# Altium schematic sheet Battery3.SchDoc
size A
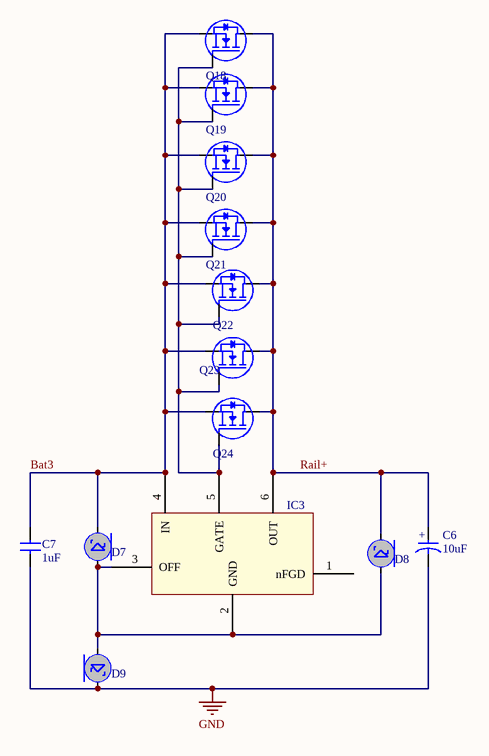
[diagram p0: Battery3.SchDoc]

## Parts
C6  value 10uF  [CAP22uF100V]  (hidden comment: CapPol)
C7  value 1uF  [CAPC1206]  (hidden comment: Cap)
D7  Schottky  [SS110-TP]  (value not drawn)
D8  SMBJ100A-13-F  [SMBJ100A-13-F]  (value not drawn)
D9  Schottky  [SS110-TP]  (value not drawn)
IC3  LM5050MK-2/NOPB  [LM5050MK-2/NOPB]  (value not drawn)
Q18  CSD19502Q5B  [CSD19502Q5B]  (value not drawn)
Q19  CSD19502Q5B  [CSD19502Q5B]  (value not drawn)
Q20  CSD19502Q5B  [CSD19502Q5B]  (value not drawn)
Q21  CSD19502Q5B  [CSD19502Q5B]  (value not drawn)
Q22  CSD19502Q5B  [CSD19502Q5B]  (value not drawn)
Q23  CSD19502Q5B  [CSD19502Q5B]  (value not drawn)
Q24  CSD19502Q5B  [CSD19502Q5B]  (value not drawn)

## Nets
GND: C6.2(B) C7.2(B) D9.C
Bat3: C7.1(A) D7.C IC3.4(IN) Q18.S Q19.S Q20.S Q21.S Q22.S Q23.S Q24.S
Rail+: C6.1(A) D8.C IC3.6(OUT) Q18.D Q19.D Q20.D Q21.D Q22.D Q23.D Q24.D
NetD7_A: D7.A D8.A D9.A IC3.2(GND) IC3.3(OFF)
NetIC3_5: IC3.5(GATE) Q18.G Q19.G Q20.G Q21.G Q22.G Q23.G Q24.G

Not connected (* = marked no-connect by the designer): IC3 1(nFGD)

## Notes on the sheet
- (in symbol CapPol) +

## Library data of the parts
D7 D9 = Schottky: Schottky Diode Template; Supplier 1: Digi-Key; Supplier Part Number 1: SS110-TPDKR-ND
D8 = SMBJ100A-13-F: TVS DIODE 100VWM 162VC SMB; Supplier 1: Digi-Key; Supplier Part Number 1: SMBJ100A-FDIDKR-ND
IC3 = LM5050MK-2/NOPB: IC OR CTRLR N+1 6SOT; Supplier 1: Digi-Key; Supplier Part Number 1: LM5050MK-2/NOPBDKR-ND
Q18-Q24 = CSD19502Q5B: NEXFET Power MOSFET; Supplier 1: Digi-Key; Supplier Part Number 1: 296-37194-1-ND
C6 = CapPol: Supplier 1: Digi-Key; Supplier Part Number 1: P5853-ND
C7 = Cap: Supplier 1: Digi-Key; Supplier Part Number 1: 587-1777-1-ND